# EAGLE schematic Simulated03 (EAGLE 9.5.2)
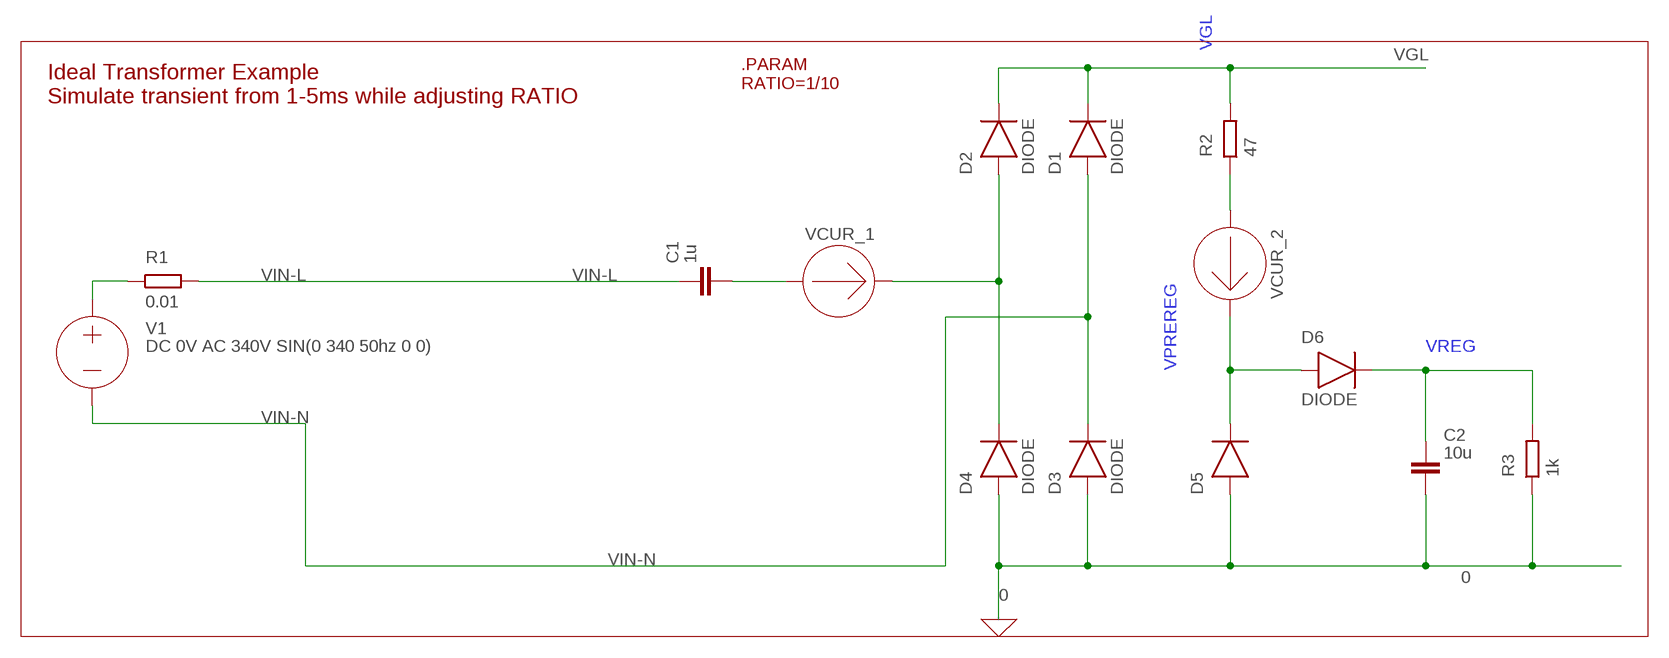
[diagram p0: schematic, sheet 1]

## Parts
C1  1u  C  (no package)
C2  10u  C  (no package)
D1  DIODE  (no package)
D2  DIODE  (no package)
D3  DIODE  (no package)
D4  DIODE  (no package)
D5  DIODE  (no package)
D6  DIODE  (no package)
R1  0.01  R  (no package)
R2  47  R  (no package)
R3  1k  R  (no package)
V1  DC 0V AC 340V SIN(0 340 50hz 0 0)  VOLTAGE  (no package)
VCUR_1  DC 0V AC 0  AMMETER  (no package)
VCUR_2  AMMETER  (no package)

## Nets
0: C2.2 D3.A D4.A D5.A R3.1 ; supply symbol labelled GND
N$1: R2.1 VCUR_2.+
N$2: R1.1 V1.+
N$3: D2.A D4.C VCUR_1.-
N$4: C1.2 VCUR_1.+
VGL [dcgnd]: D1.C D2.C R2.2
VIN-L: C1.1 R1.2
VIN-N: D1.A D3.C V1.-
VPREREG: D5.C D6.A VCUR_2.-
VREG: C2.1 D6.C R3.2

## Notes on the sheet
- .PARAM
  RATIO=1/10
- Ideal Transformer Example
  Simulate transient from 1-5ms while adjusting RATIO

## Library data of the parts
C1 C2 = ngspice-simulation:C: CAPACITOR
D1-D4 D6 = ngspice-simulation:DIODE: Diode; SPICEPREFIX: D
D5 = ngspice-simulation:DIODE: Diode; SPICEMODEL: DI_BZT52C9V1LP; SPICEPREFIX: X
R1-R3 = ngspice-simulation:R: RESISTOR
V1 = ngspice-simulation:VOLTAGE: Independent Voltage Source, either DC, AC, PULSE, SINE, PWL, EXP, or SFFM; VALUE: 0V
VCUR_1 VCUR_2 = ngspice-simulation:AMMETER: AMMETER